# EAGLE schematic 0x6Connection (EAGLE 7.3.0)
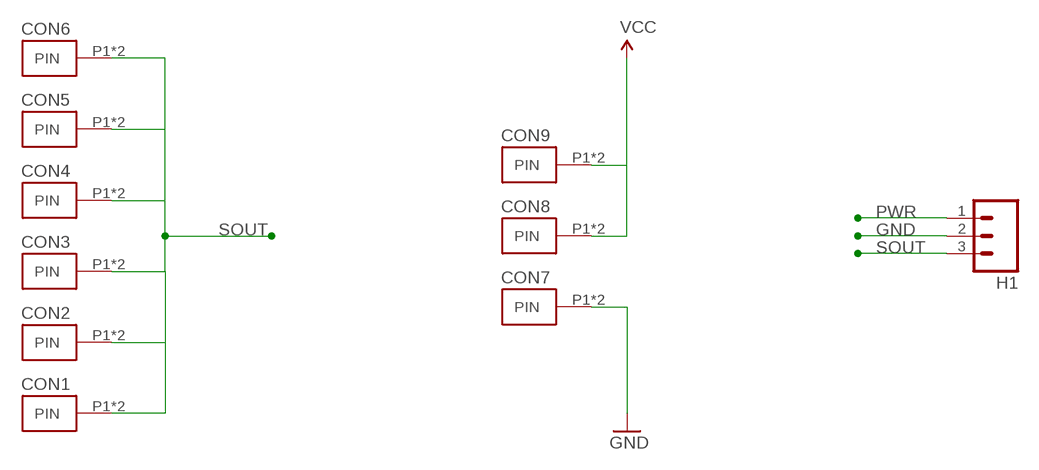
[diagram p0: schematic, sheet 1]

## Parts
CON1  SHIELD_FINGER0820  [SHIELD_FINGER_PKG]
CON2  SHIELD_FINGER0820  [SHIELD_FINGER_PKG]
CON3  SHIELD_FINGER0820  [SHIELD_FINGER_PKG]
CON4  SHIELD_FINGER0820  [SHIELD_FINGER_PKG]
CON5  SHIELD_FINGER0820  [SHIELD_FINGER_PKG]
CON6  SHIELD_FINGER0820  [SHIELD_FINGER_PKG]
CON7  SHIELD_FINGER0820  [SHIELD_FINGER_PKG]
CON8  SHIELD_FINGER0820  [SHIELD_FINGER_PKG]
CON9  SHIELD_FINGER0820  [SHIELD_FINGER_PKG]
H1  M031X03_NO_HOLES  [1X03_NO_HOLES]

## Nets
GND: CON7.P1(PIN) CON7.P2(PIN) H1.2
PWR: CON8.P1(PIN) CON8.P2(PIN) CON9.P1(PIN) CON9.P2(PIN) H1.1 ; supply symbol labelled VCC
SOUT: CON1.P1(PIN) CON1.P2(PIN) CON2.P1(PIN) CON2.P2(PIN) CON3.P1(PIN) CON3.P2(PIN) CON4.P1(PIN) CON4.P2(PIN) CON5.P1(PIN) CON5.P2(PIN) CON6.P1(PIN) CON6.P2(PIN) H1.3

## Library data of the parts
CON1-CON9 = MakerShoe:SHIELD_FINGER
H1 = SparkFun-Connectors:M03: Header 3 Standard 3-pin 0.1" header. Use with straight break away headers (SKU : PRT-00116), right angle break away headers (PRT-00553), swiss pins (PRT-00743), machine pins (PRT-00117), and female headers (PRT-00115). Molex polarized connector foot print use with SKU : PRT-08232 with associated crimp pins and housings.